# Altium schematic sheet Connectors.SchDoc
size A; SheetNumber: 1; SheetTotal: 6
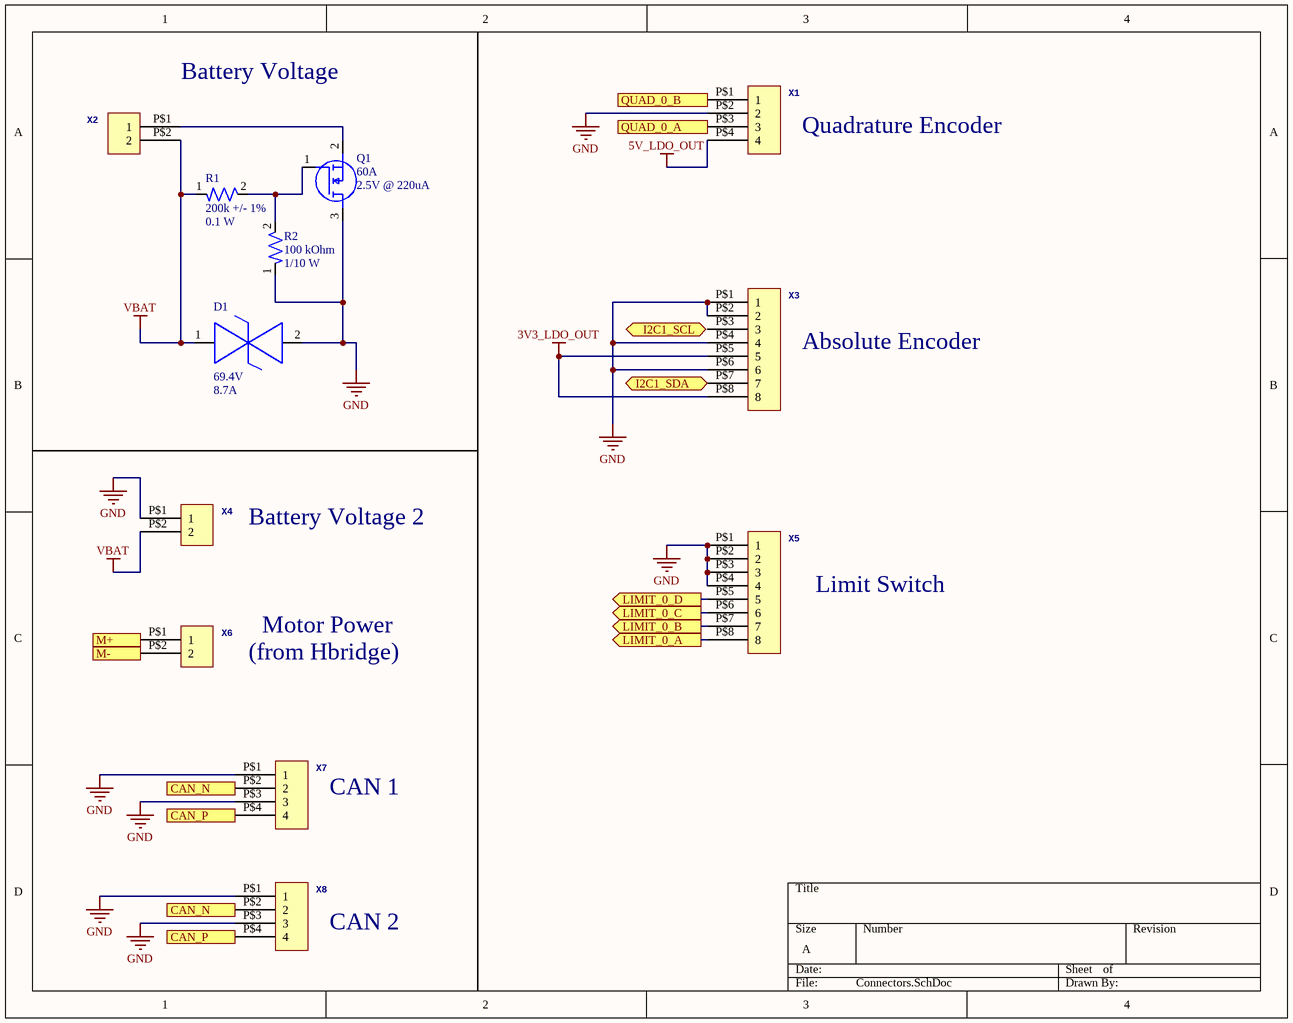
[diagram p0: Connectors.SchDoc]

## Parts
D1  Vclamp: 69.4V  Peak pulser current: 8.7A  [DO-214AA (SMBJ)]  (hidden comment: SMBJE43CAH)
Q1  Drain Current: 60A  Vgs: 2.5V @ 220uA  [NMOS-8PowerVDFN]  (hidden comment: TPH7R006PL,L1Q)
R1  Resistance: 200k +/- 1%  Power Rating: 0.1 W  [RES-0603]  (hidden comment: ERJ-3EKF2003V)
R2  Resistance: 100 kOhm  Power: 1/10 W  [RES-0603]  (hidden comment: RC0603FR-07100KL)
X1  Molex 43045-0412  [43045-0412]  (value not drawn)
X2  Molex 43650-0215  [43650-0215]  (value not drawn)
X3  Molex 43045-0812  [43045-0812]  (value not drawn)
X4  Molex 43650-0215  [43650-0215]  (value not drawn)
X5  Molex 43045-0812  [43045-0812]  (value not drawn)
X6  Molex 43650-0215  [43650-0215]  (value not drawn)
X7  Molex 43045-0412  [43045-0412]  (value not drawn)
X8  Molex 43045-0412  [43045-0412]  (value not drawn)

## Ports
CAN_N (in, see Connectors[1D], MCU_CAN[6B]), CAN_P (in, see Connectors[1D], MCU_CAN[6A]), I2C1_SCL (bidir, see MCU_CAN[3B]), I2C1_SDA (bidir, see MCU_CAN[3B]), LIMIT_0_A (out, see MCU_CAN[2C]), LIMIT_0_B (out, see MCU_CAN[2C]), LIMIT_0_C (out, see MCU_CAN[2C]), LIMIT_0_D (out, see MCU_CAN[2C]), M+ (in, see HBridge_Design[2B]), M- (in, see HBridge_Design[2B]), QUAD_0_A (out, see MCU_CAN[3B]), QUAD_0_B (out, see MCU_CAN[3B])

## Nets
3V3_LDO_OUT: X3.P$5(5) X3.P$8(8)
5V_LDO_OUT: X1.P$4(4)
GND: D1.2 Q1.3(D) R2.1 X1.P$2(2) X3.P$1(1) X3.P$2(2) X3.P$4(4) X3.P$6(6) X4.P$1(1) X5.P$1(1) X5.P$2(2) X5.P$3(3) X5.P$4(4) X7.P$1(1) X7.P$3(3) X8.P$1(1) X8.P$3(3)
VBAT: D1.1 R1.1 X2.P$2(2) X4.P$2(2)
CAN_N: X7.P$2(2) X8.P$2(2) ; port CAN_N
CAN_P: X7.P$4(4) X8.P$4(4) ; port CAN_P
I2C1_SDA: X3.P$7(7) ; port I2C1_SDA
LIMIT_0_A: X5.P$8(8) ; port LIMIT_0_A
LIMIT_0_B: X5.P$7(7) ; port LIMIT_0_B
LIMIT_0_C: X5.P$6(6) ; port LIMIT_0_C
LIMIT_0_D: X5.P$5(5) ; port LIMIT_0_D
M+: X6.P$1(1) ; port M+
M-: X6.P$2(2) ; port M-
QUAD_0_A: X1.P$3(3) ; port QUAD_0_A
QUAD_0_B: X1.P$1(1) ; port QUAD_0_B
NetQ1_1: Q1.1(G) R1.2 R2.2
NetQ1_2: Q1.2(S) X2.P$1(1)

Not connected (* = marked no-connect by the designer): X3 P$3(3)

## Notes on the sheet
- Battery Voltage
- Quadrature Encoder
- Absolute Encoder
- Battery Voltage 2
- Motor Power
- Limit Switch
- (from Hbridge)
- CAN 1
- CAN 2

## Library data of the parts
D1 = DIO-69.4V-0001: 69.4V Clamp 8.7A Ipp Tvs Diode Surface Mount DO-214AA (SMBJ); Channels: Bidirectional; Breakdown VOltage: 47.8V; Reverse working maximum voltage: 43V; Package: DO-214AA (SMBJ)
Q1 = NMOS-60A-0001: N-Channel 60 V 60A (Tc) 81W (Tc) Surface Mount 8-SOP Advance (5x5); Vdss: 60V; Vgs(Max): 20V; Package: 8-PowerVDFN
R1 = RES-200K-0001: 200 kOhms ±1% 0.1W, 1/10W Chip Resistor 0603 (1608 Metric) Automotive AEC-Q200 Thick Film; Manufacturer: Panasonic Electronic Components; Assembled?: Yes; MFP: ERJ-3EKF2003V; Package SIze: 0603
R2 = RES-100K-0003: 100 kOhms ±1% 0.1W, 1/10W Chip Resistor 0603 (1608 Metric) Moisture Resistant Thick Film; Tolerance: +/- 1%; Assembled?: No; Package Size: 0603
X1 X7 X8 = Micro-Fit Molex 4 Pin 2 Row Vertical: GateName_1: G$1; SymbolName_1: HEADER_POS4; DeviceSetName: HEADER_POS4_?; DeviceName: 43045-0412; LibraryName: con-molex-micro-fit-3_0_2; Package: 43045-0412
X2 X4 X6 = Micro-Fit Molex 2 Pin Vertical: GateName_1: G$1; SymbolName_1: HEADER_POS2; DeviceSetName: HEADER_POS2_?; DeviceName: 43650-0215; LibraryName: con-molex-micro-fit-3_0_2; Package: 43650-0215
X3 X5 = Micro-Fit Molex 8 Pin 2 Row Vertical: GateName_1: G$1; SymbolName_1: HEADER_POS8; DeviceSetName: HEADER_POS8_?; DeviceName: 43045-0812; LibraryName: con-molex-micro-fit-3_0_2; Package: 43045-0812